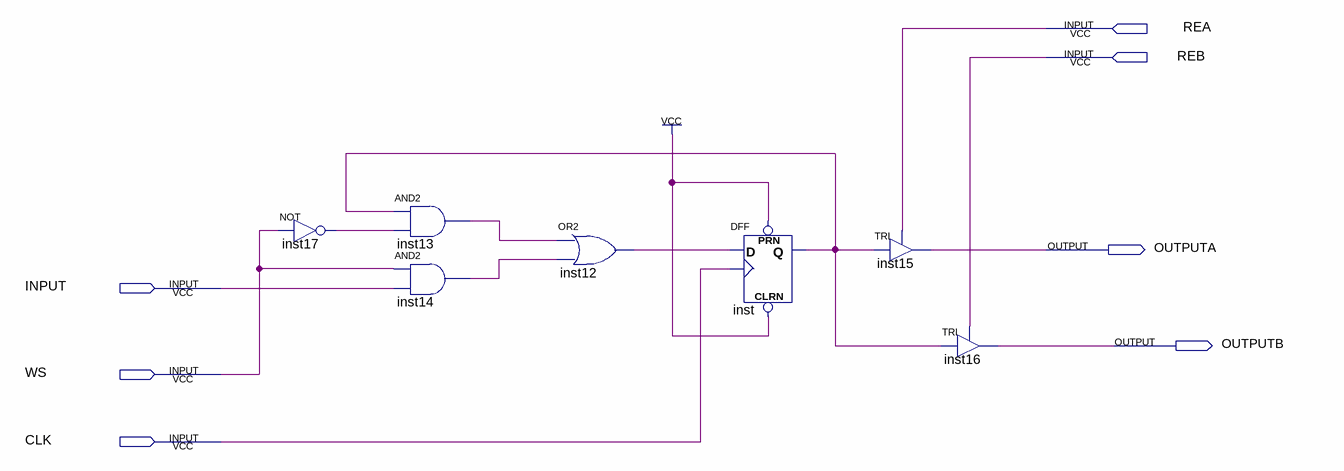
[diagram p0: schematic sheet]
// Quartus schematic RFC.bdf as structural Verilog: 7 symbols, 7 pins
module RFC (
  input  REA,
  input  REB,
  input  INPUT,
  input  WS,
  input  CLK,
  output OUTPUTA,
  output OUTPUTB
);

  wire inst12_out, inst13_out, inst14_out, inst17_out, inst_q;

  not inst17 (inst17_out, WS);
  and inst13 (inst13_out, inst_q, inst17_out);
  and inst14 (inst14_out, WS, INPUT);
  or inst12 (inst12_out, inst13_out, inst14_out);
  DFF inst (.CLRN(1'b1), .CLK(CLK), .D(inst12_out), .PRN(1'b1), .Q(inst_q));
  TRI inst15 (.IN(inst_q), .OE(REA), .OUT(OUTPUTA));
  TRI inst16 (.IN(inst_q), .OE(REB), .OUT(OUTPUTB));
endmodule
